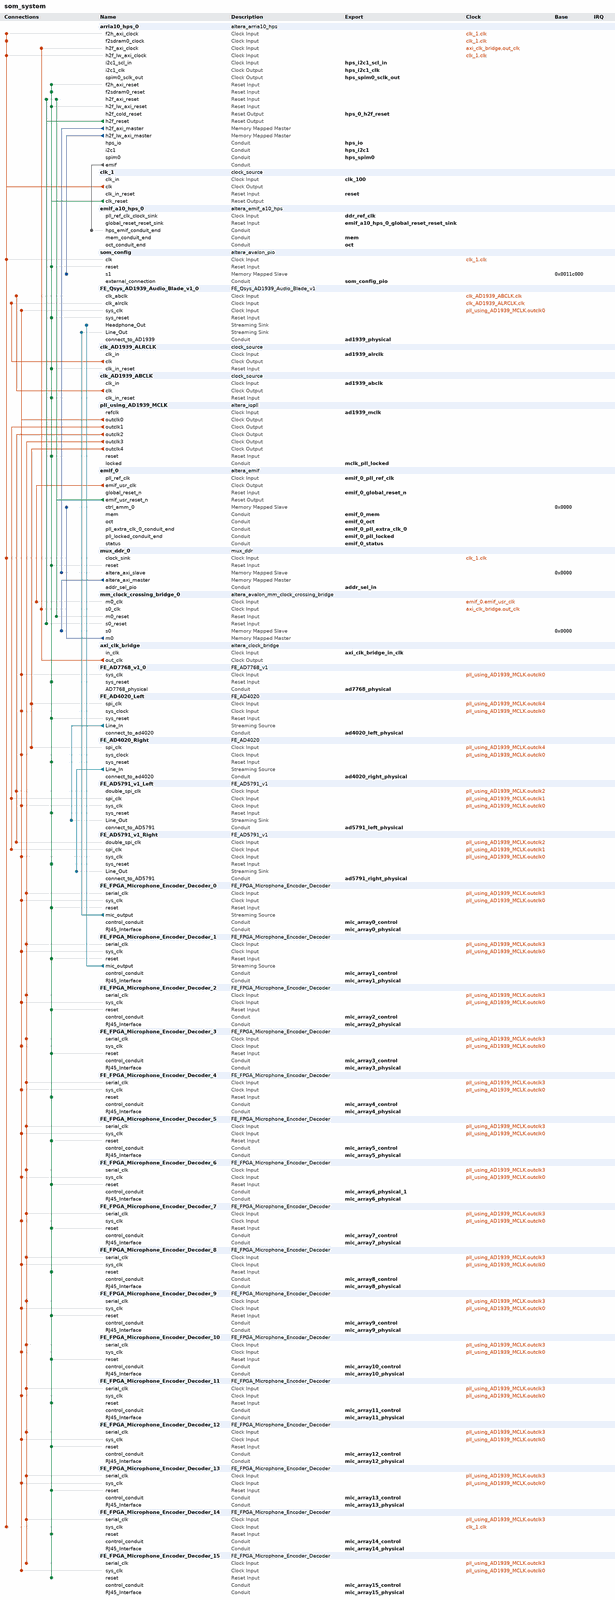
[diagram p0: system contents, whole]
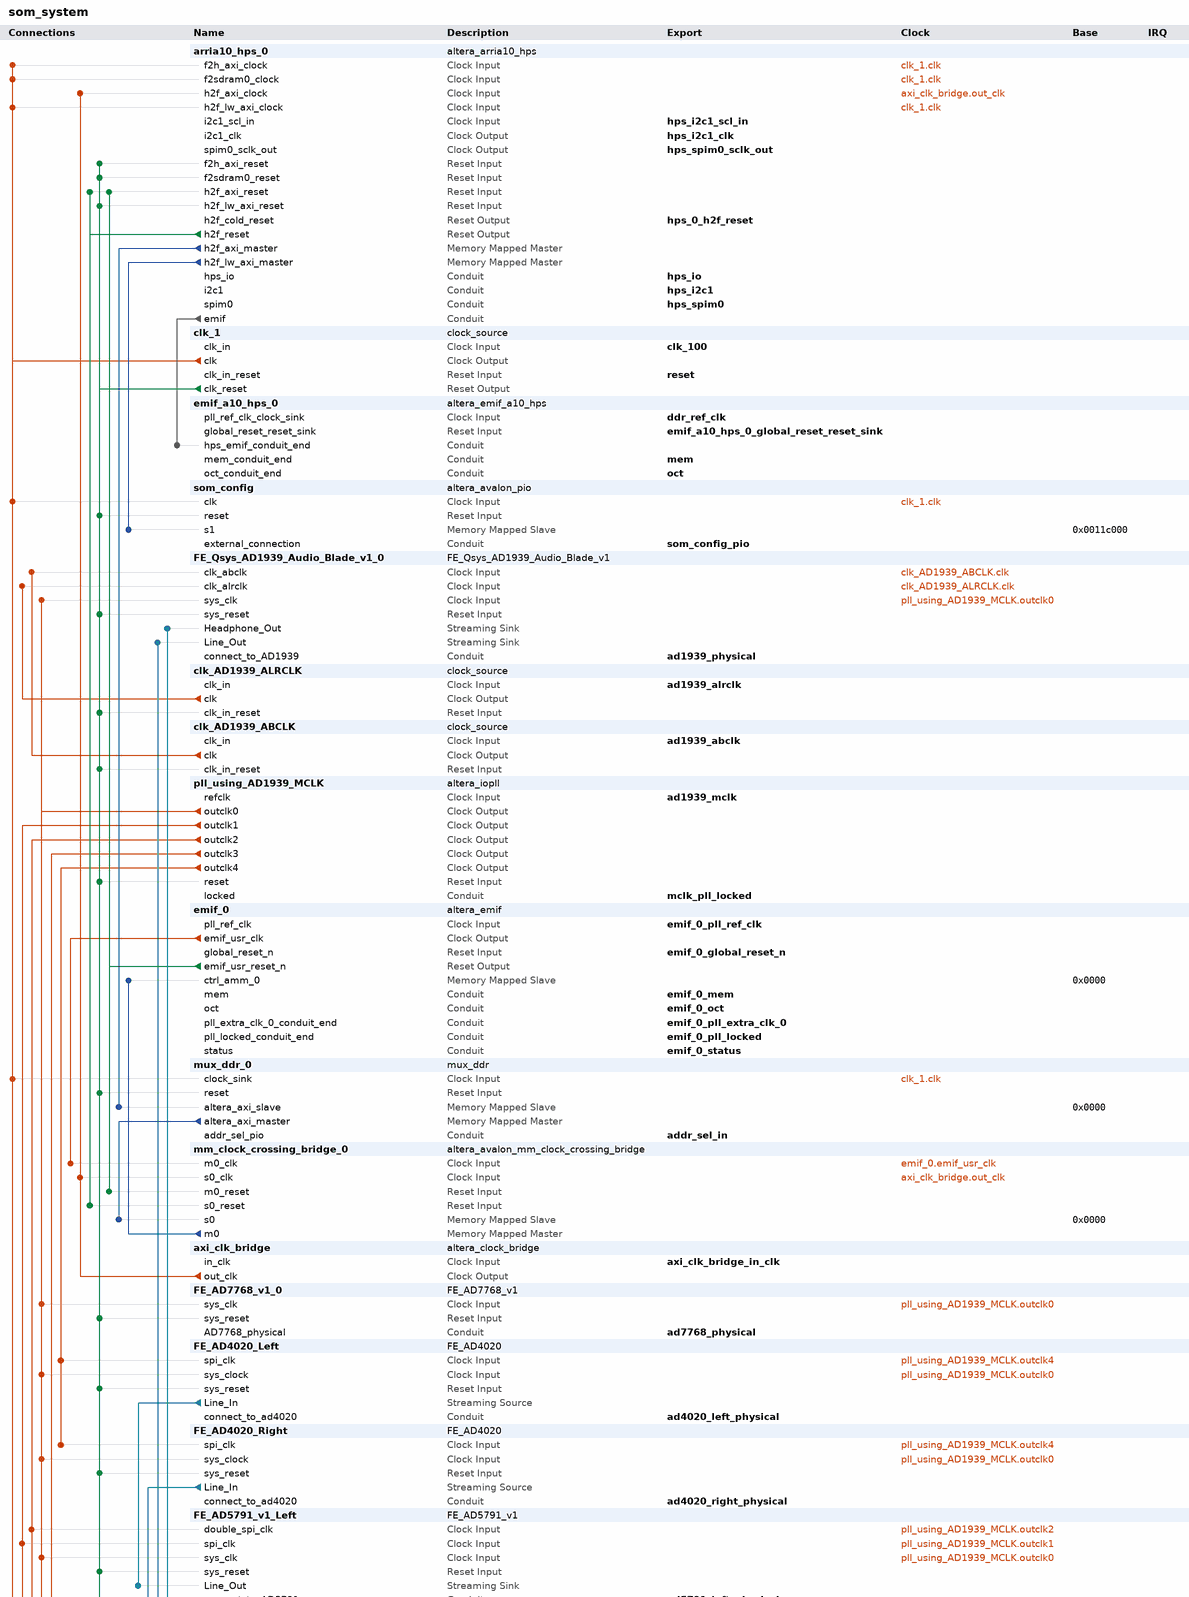
[diagram p1: system contents, upper part]
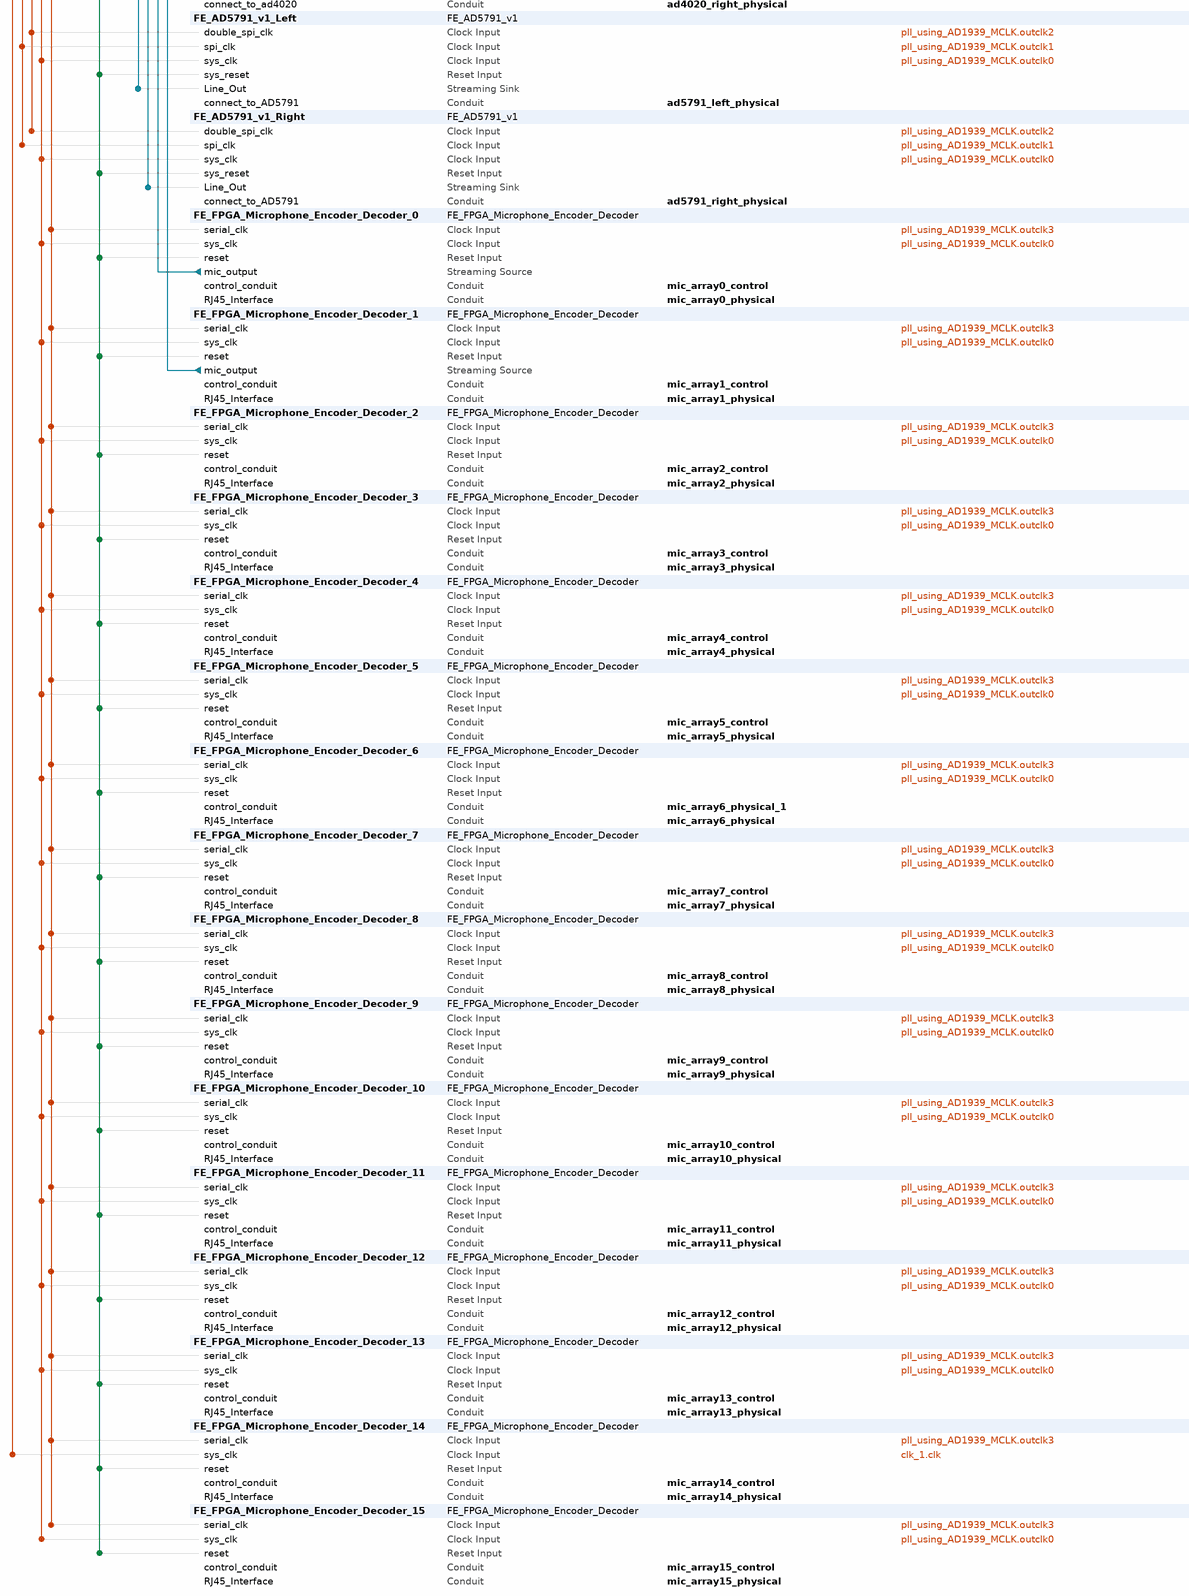
[diagram p2: system contents, lower part]
# Platform Designer (Qsys) system som_system, Arria 10 10AS066H2F34I1HG
# Parameters at their usual value, and those the tool derives, are not listed.
package require -exact qsys 18.0
create_system som_system
set_project_property DEVICE_FAMILY {Arria 10}
set_project_property DEVICE 10AS066H2F34I1HG

add_instance arria10_hps_0 altera_arria10_hps 18.0
set_instance_parameter_value arria10_hps_0 BOOT_FROM_FPGA_Enable false
set_instance_parameter_value arria10_hps_0 BSEL 1
set_instance_parameter_value arria10_hps_0 BSEL_EN false
set_instance_parameter_value arria10_hps_0 CLK_EMACA_SOURCE 1
set_instance_parameter_value arria10_hps_0 CLK_EMACB_SOURCE 1
set_instance_parameter_value arria10_hps_0 CLK_EMAC_PTP_SOURCE 1
set_instance_parameter_value arria10_hps_0 CLK_GPIO_SOURCE 1
set_instance_parameter_value arria10_hps_0 CLK_HMC_PLL_SOURCE 0
set_instance_parameter_value arria10_hps_0 CLK_MAIN_PLL_SOURCE2 0
set_instance_parameter_value arria10_hps_0 CLK_MPU_CNT 0
set_instance_parameter_value arria10_hps_0 CLK_MPU_SOURCE 0
set_instance_parameter_value arria10_hps_0 CLK_NOC_CNT 0
set_instance_parameter_value arria10_hps_0 CLK_NOC_SOURCE 0
set_instance_parameter_value arria10_hps_0 CLK_PERI_PLL_SOURCE2 0
set_instance_parameter_value arria10_hps_0 CLK_S2F_USER0_SOURCE 0
set_instance_parameter_value arria10_hps_0 CLK_S2F_USER1_SOURCE 0
set_instance_parameter_value arria10_hps_0 CLK_SDMMC_SOURCE 0
set_instance_parameter_value arria10_hps_0 CM_Mode N/A
set_instance_parameter_value arria10_hps_0 CM_PinMuxing Unused
set_instance_parameter_value arria10_hps_0 CTI_Enable false
set_instance_parameter_value arria10_hps_0 CUSTOM_MPU_CLK 800
set_instance_parameter_value arria10_hps_0 DEBUG_APB_Enable false
set_instance_parameter_value arria10_hps_0 DISABLE_PERI_PLL false
set_instance_parameter_value arria10_hps_0 DMA_Enable No,No,No,No,No,No,No,No
set_instance_parameter_value arria10_hps_0 EMAC0_CLK 250
set_instance_parameter_value arria10_hps_0 EMAC0_Mode N/A
set_instance_parameter_value arria10_hps_0 EMAC0_PTP false
set_instance_parameter_value arria10_hps_0 EMAC0_PinMuxing Unused
set_instance_parameter_value arria10_hps_0 EMAC0_SWITCH_Enable false
set_instance_parameter_value arria10_hps_0 EMAC1_CLK 250
set_instance_parameter_value arria10_hps_0 EMAC1_Mode RGMII_with_MDIO
set_instance_parameter_value arria10_hps_0 EMAC1_PTP false
set_instance_parameter_value arria10_hps_0 EMAC1_PinMuxing IO
set_instance_parameter_value arria10_hps_0 EMAC1_SWITCH_Enable false
set_instance_parameter_value arria10_hps_0 EMAC2_CLK 250
set_instance_parameter_value arria10_hps_0 EMAC2_Mode N/A
set_instance_parameter_value arria10_hps_0 EMAC2_PTP false
set_instance_parameter_value arria10_hps_0 EMAC2_PinMuxing Unused
set_instance_parameter_value arria10_hps_0 EMAC2_SWITCH_Enable false
set_instance_parameter_value arria10_hps_0 EMAC_PTP_REF_CLK 100
set_instance_parameter_value arria10_hps_0 EMIF_BYPASS_CHECK false
set_instance_parameter_value arria10_hps_0 EMIF_CONDUIT_Enable true
set_instance_parameter_value arria10_hps_0 F2H_AXI_CLOCK_FREQ 100000000
set_instance_parameter_value arria10_hps_0 F2H_COLD_RST_Enable false
set_instance_parameter_value arria10_hps_0 F2H_DBG_RST_Enable false
set_instance_parameter_value arria10_hps_0 F2H_FREE_CLK_Enable false
set_instance_parameter_value arria10_hps_0 F2H_FREE_CLK_FREQ 200
set_instance_parameter_value arria10_hps_0 F2H_SDRAM0_CLOCK_FREQ 100
set_instance_parameter_value arria10_hps_0 F2H_SDRAM1_CLOCK_FREQ 100
set_instance_parameter_value arria10_hps_0 F2H_SDRAM2_CLOCK_FREQ 100
set_instance_parameter_value arria10_hps_0 F2H_SDRAM3_CLOCK_FREQ 100
set_instance_parameter_value arria10_hps_0 F2H_SDRAM4_CLOCK_FREQ 100
set_instance_parameter_value arria10_hps_0 F2H_SDRAM5_CLOCK_FREQ 100
set_instance_parameter_value arria10_hps_0 F2H_WARM_RST_Enable false
set_instance_parameter_value arria10_hps_0 F2SDRAM0_ENABLED true
set_instance_parameter_value arria10_hps_0 F2SDRAM1_ENABLED false
set_instance_parameter_value arria10_hps_0 F2SDRAM2_DELAY 4
set_instance_parameter_value arria10_hps_0 F2SDRAM2_ENABLED false
set_instance_parameter_value arria10_hps_0 F2SDRAM_ADDRESS_WIDTH 32
set_instance_parameter_value arria10_hps_0 F2SDRAM_PORT_CONFIG 6
set_instance_parameter_value arria10_hps_0 F2SDRAM_READY_LATENCY true
set_instance_parameter_value arria10_hps_0 F2SINTERRUPT_Enable true
set_instance_parameter_value arria10_hps_0 F2S_Width 6
set_instance_parameter_value arria10_hps_0 FPGA_PERIPHERAL_INPUT_CLOCK_FREQ_EMAC0_RX_CLK_IN 100
set_instance_parameter_value arria10_hps_0 FPGA_PERIPHERAL_INPUT_CLOCK_FREQ_EMAC0_TX_CLK_IN 100
set_instance_parameter_value arria10_hps_0 FPGA_PERIPHERAL_INPUT_CLOCK_FREQ_EMAC1_RX_CLK_IN 100
set_instance_parameter_value arria10_hps_0 FPGA_PERIPHERAL_INPUT_CLOCK_FREQ_EMAC1_TX_CLK_IN 100
set_instance_parameter_value arria10_hps_0 FPGA_PERIPHERAL_INPUT_CLOCK_FREQ_EMAC2_RX_CLK_IN 100
set_instance_parameter_value arria10_hps_0 FPGA_PERIPHERAL_INPUT_CLOCK_FREQ_EMAC2_TX_CLK_IN 100
set_instance_parameter_value arria10_hps_0 FPGA_PERIPHERAL_INPUT_CLOCK_FREQ_EMAC_PTP_REF_CLOCK 100
set_instance_parameter_value arria10_hps_0 FPGA_PERIPHERAL_INPUT_CLOCK_FREQ_I2C0_SCL_IN 100
set_instance_parameter_value arria10_hps_0 FPGA_PERIPHERAL_INPUT_CLOCK_FREQ_I2C1_SCL_IN 0
set_instance_parameter_value arria10_hps_0 FPGA_PERIPHERAL_INPUT_CLOCK_FREQ_I2CEMAC0_SCL_IN 100
set_instance_parameter_value arria10_hps_0 FPGA_PERIPHERAL_INPUT_CLOCK_FREQ_I2CEMAC1_SCL_IN 100
set_instance_parameter_value arria10_hps_0 FPGA_PERIPHERAL_INPUT_CLOCK_FREQ_I2CEMAC2_SCL_IN 100
set_instance_parameter_value arria10_hps_0 FPGA_PERIPHERAL_INPUT_CLOCK_FREQ_SDMMC_CLK_IN 100
set_instance_parameter_value arria10_hps_0 FPGA_PERIPHERAL_INPUT_CLOCK_FREQ_SPIS0_SCLK_IN 100
set_instance_parameter_value arria10_hps_0 FPGA_PERIPHERAL_INPUT_CLOCK_FREQ_SPIS1_SCLK_IN 100
set_instance_parameter_value arria10_hps_0 FPGA_PERIPHERAL_INPUT_CLOCK_FREQ_USB0_CLK_IN 100
set_instance_parameter_value arria10_hps_0 FPGA_PERIPHERAL_INPUT_CLOCK_FREQ_USB1_CLK_IN 100
set_instance_parameter_value arria10_hps_0 FPGA_PERIPHERAL_OUTPUT_CLOCK_FREQ_EMAC0_GTX_CLK 100
set_instance_parameter_value arria10_hps_0 FPGA_PERIPHERAL_OUTPUT_CLOCK_FREQ_EMAC0_MD_CLK 2.5
set_instance_parameter_value arria10_hps_0 FPGA_PERIPHERAL_OUTPUT_CLOCK_FREQ_EMAC1_GTX_CLK 100
set_instance_parameter_value arria10_hps_0 FPGA_PERIPHERAL_OUTPUT_CLOCK_FREQ_EMAC1_MD_CLK 2.5
set_instance_parameter_value arria10_hps_0 FPGA_PERIPHERAL_OUTPUT_CLOCK_FREQ_EMAC2_GTX_CLK 100
set_instance_parameter_value arria10_hps_0 FPGA_PERIPHERAL_OUTPUT_CLOCK_FREQ_EMAC2_MD_CLK 2.5
set_instance_parameter_value arria10_hps_0 FPGA_PERIPHERAL_OUTPUT_CLOCK_FREQ_I2C0_CLK 100
set_instance_parameter_value arria10_hps_0 FPGA_PERIPHERAL_OUTPUT_CLOCK_FREQ_I2C1_CLK 100
set_instance_parameter_value arria10_hps_0 FPGA_PERIPHERAL_OUTPUT_CLOCK_FREQ_I2CEMAC0_CLK 100
set_instance_parameter_value arria10_hps_0 FPGA_PERIPHERAL_OUTPUT_CLOCK_FREQ_I2CEMAC1_CLK 100
set_instance_parameter_value arria10_hps_0 FPGA_PERIPHERAL_OUTPUT_CLOCK_FREQ_I2CEMAC2_CLK 100
set_instance_parameter_value arria10_hps_0 FPGA_PERIPHERAL_OUTPUT_CLOCK_FREQ_QSPI_SCLK_OUT 100
set_instance_parameter_value arria10_hps_0 FPGA_PERIPHERAL_OUTPUT_CLOCK_FREQ_SDMMC_CCLK 100
set_instance_parameter_value arria10_hps_0 FPGA_PERIPHERAL_OUTPUT_CLOCK_FREQ_SPIM0_SCLK_OUT 100
set_instance_parameter_value arria10_hps_0 FPGA_PERIPHERAL_OUTPUT_CLOCK_FREQ_SPIM1_SCLK_OUT 100
set_instance_parameter_value arria10_hps_0 GPIO_REF_CLK 4
set_instance_parameter_value arria10_hps_0 GP_Enable false
set_instance_parameter_value arria10_hps_0 H2F_AXI_CLOCK_FREQ 0
set_instance_parameter_value arria10_hps_0 H2F_COLD_RST_Enable true
set_instance_parameter_value arria10_hps_0 H2F_CTI_CLOCK_FREQ 100
set_instance_parameter_value arria10_hps_0 H2F_DEBUG_APB_CLOCK_FREQ 100
set_instance_parameter_value arria10_hps_0 H2F_LW_AXI_CLOCK_FREQ 100000000
set_instance_parameter_value arria10_hps_0 H2F_PENDING_RST_Enable false
set_instance_parameter_value arria10_hps_0 H2F_TPIU_CLOCK_IN_FREQ 100
set_instance_parameter_value arria10_hps_0 H2F_USER0_CLK_Enable true
set_instance_parameter_value arria10_hps_0 H2F_USER0_CLK_FREQ 100
set_instance_parameter_value arria10_hps_0 H2F_USER1_CLK_Enable false
set_instance_parameter_value arria10_hps_0 H2F_USER1_CLK_FREQ 400
set_instance_parameter_value arria10_hps_0 HMC_PLL_REF_CLK 800
set_instance_parameter_value arria10_hps_0 HPS_DIV_GPIO_FREQ 125
set_instance_parameter_value arria10_hps_0 HPS_IO_Enable SDMMC:D0,SDMMC:CMD,SDMMC:CCLK,SDMMC:D1,SDMMC:D2,SDMMC:D3,GPIO,NONE,GPIO,NONE,NONE,NONE,UART1:TX,UART1:RX,GPIO,GPIO,NONE,NONE,I2C0:SDA,I2C0:SCL,GPIO,NONE,MDIO1:MDIO,MDIO1:MDC,NONE,GPIO,USB1:CLK,USB1:STP,USB1:DIR,USB1:DATA0,USB1:DATA1,USB1:NXT,USB1:DATA2,USB1:DATA3,USB1:DATA4,USB1:DATA5,USB1:DATA6,USB1:DATA7,EMAC1:TX_CLK,EMAC1:TX_CTL,EMAC1:RX_CLK,EMAC1:RX_CTL,EMAC1:TXD0,EMAC1:TXD1,EMAC1:RXD0,EMAC1:RXD1,EMAC1:TXD2,EMAC1:TXD3,EMAC1:RXD2,EMAC1:RXD3,GPIO,GPIO,GPIO,GPIO,GPIO,GPIO,GPIO,GPIO,GPIO,GPIO,GPIO,GPIO
set_instance_parameter_value arria10_hps_0 I2C0_Mode default
set_instance_parameter_value arria10_hps_0 I2C0_PinMuxing IO
set_instance_parameter_value arria10_hps_0 I2C1_Mode default
set_instance_parameter_value arria10_hps_0 I2C1_PinMuxing FPGA
set_instance_parameter_value arria10_hps_0 I2CEMAC0_Mode N/A
set_instance_parameter_value arria10_hps_0 I2CEMAC0_PinMuxing Unused
set_instance_parameter_value arria10_hps_0 I2CEMAC1_Mode N/A
set_instance_parameter_value arria10_hps_0 I2CEMAC1_PinMuxing Unused
set_instance_parameter_value arria10_hps_0 I2CEMAC2_Mode N/A
set_instance_parameter_value arria10_hps_0 I2CEMAC2_PinMuxing Unused
set_instance_parameter_value arria10_hps_0 INTERNAL_OSCILLATOR_ENABLE 60
set_instance_parameter_value arria10_hps_0 JTAG_Enable false
set_instance_parameter_value arria10_hps_0 L3_MAIN_FREE_CLK 500
set_instance_parameter_value arria10_hps_0 L4_SYS_FREE_CLK 1
set_instance_parameter_value arria10_hps_0 LWH2F_Enable 2
set_instance_parameter_value arria10_hps_0 MPU_CLK_VCCL 1
set_instance_parameter_value arria10_hps_0 MPU_EVENTS_Enable false
set_instance_parameter_value arria10_hps_0 NAND_Mode N/A
set_instance_parameter_value arria10_hps_0 NAND_PinMuxing Unused
set_instance_parameter_value arria10_hps_0 NOCDIV_CS_ATCLK 0
set_instance_parameter_value arria10_hps_0 NOCDIV_CS_PDBGCLK 1
set_instance_parameter_value arria10_hps_0 NOCDIV_CS_TRACECLK 0
set_instance_parameter_value arria10_hps_0 NOCDIV_L4MAINCLK 0
set_instance_parameter_value arria10_hps_0 NOCDIV_L4MPCLK 1
set_instance_parameter_value arria10_hps_0 NOCDIV_L4SPCLK 2
set_instance_parameter_value arria10_hps_0 OVERIDE_PERI_PLL false
set_instance_parameter_value arria10_hps_0 PERI_PLL_MANUAL_VCO_FREQ 2000
set_instance_parameter_value arria10_hps_0 PLL_CLK0 Unused
set_instance_parameter_value arria10_hps_0 PLL_CLK1 Unused
set_instance_parameter_value arria10_hps_0 PLL_CLK2 Unused
set_instance_parameter_value arria10_hps_0 PLL_CLK3 Unused
set_instance_parameter_value arria10_hps_0 PLL_CLK4 Unused
set_instance_parameter_value arria10_hps_0 QSPI_Mode N/A
set_instance_parameter_value arria10_hps_0 QSPI_PinMuxing Unused
set_instance_parameter_value arria10_hps_0 RUN_INTERNAL_BUILD_CHECKS 0
set_instance_parameter_value arria10_hps_0 S2FINTERRUPT_CLOCKPERIPHERAL_Enable false
set_instance_parameter_value arria10_hps_0 S2FINTERRUPT_CTI_Enable false
set_instance_parameter_value arria10_hps_0 S2FINTERRUPT_DMA_Enable false
set_instance_parameter_value arria10_hps_0 S2FINTERRUPT_EMAC0_Enable false
set_instance_parameter_value arria10_hps_0 S2FINTERRUPT_EMAC1_Enable false
set_instance_parameter_value arria10_hps_0 S2FINTERRUPT_EMAC2_Enable false
set_instance_parameter_value arria10_hps_0 S2FINTERRUPT_FPGAMANAGER_Enable false
set_instance_parameter_value arria10_hps_0 S2FINTERRUPT_GPIO_Enable false
set_instance_parameter_value arria10_hps_0 S2FINTERRUPT_HMC_Enable false
set_instance_parameter_value arria10_hps_0 S2FINTERRUPT_I2C0_Enable false
set_instance_parameter_value arria10_hps_0 S2FINTERRUPT_I2C1_Enable false
set_instance_parameter_value arria10_hps_0 S2FINTERRUPT_I2CEMAC0_Enable false
set_instance_parameter_value arria10_hps_0 S2FINTERRUPT_I2CEMAC1_Enable false
set_instance_parameter_value arria10_hps_0 S2FINTERRUPT_I2CEMAC2_Enable false
set_instance_parameter_value arria10_hps_0 S2FINTERRUPT_L4TIMER_Enable false
set_instance_parameter_value arria10_hps_0 S2FINTERRUPT_NAND_Enable false
set_instance_parameter_value arria10_hps_0 S2FINTERRUPT_QSPI_Enable false
set_instance_parameter_value arria10_hps_0 S2FINTERRUPT_SDMMC_Enable false
set_instance_parameter_value arria10_hps_0 S2FINTERRUPT_SPIM0_Enable false
set_instance_parameter_value arria10_hps_0 S2FINTERRUPT_SPIM1_Enable false
set_instance_parameter_value arria10_hps_0 S2FINTERRUPT_SPIS0_Enable false
set_instance_parameter_value arria10_hps_0 S2FINTERRUPT_SPIS1_Enable false
set_instance_parameter_value arria10_hps_0 S2FINTERRUPT_SYSTEMMANAGER_Enable false
set_instance_parameter_value arria10_hps_0 S2FINTERRUPT_SYSTIMER_Enable false
set_instance_parameter_value arria10_hps_0 S2FINTERRUPT_UART0_Enable false
set_instance_parameter_value arria10_hps_0 S2FINTERRUPT_UART1_Enable false
set_instance_parameter_value arria10_hps_0 S2FINTERRUPT_USB0_Enable false
set_instance_parameter_value arria10_hps_0 S2FINTERRUPT_USB1_Enable false
set_instance_parameter_value arria10_hps_0 S2FINTERRUPT_WATCHDOG_Enable false
set_instance_parameter_value arria10_hps_0 S2F_Width 6
set_instance_parameter_value arria10_hps_0 SDMMC_Mode 4-bit
set_instance_parameter_value arria10_hps_0 SDMMC_PinMuxing IO
set_instance_parameter_value arria10_hps_0 SDMMC_REF_CLK 200
set_instance_parameter_value arria10_hps_0 SECURITY_MODULE_Enable false
set_instance_parameter_value arria10_hps_0 SPIM0_Mode Single_slave_selects
set_instance_parameter_value arria10_hps_0 SPIM0_PinMuxing FPGA
set_instance_parameter_value arria10_hps_0 SPIM1_Mode N/A
set_instance_parameter_value arria10_hps_0 SPIM1_PinMuxing Unused
set_instance_parameter_value arria10_hps_0 SPIS0_Mode N/A
set_instance_parameter_value arria10_hps_0 SPIS0_PinMuxing Unused
set_instance_parameter_value arria10_hps_0 SPIS1_Mode N/A
set_instance_parameter_value arria10_hps_0 SPIS1_PinMuxing Unused
set_instance_parameter_value arria10_hps_0 STM_Enable false
set_instance_parameter_value arria10_hps_0 TESTIOCTRL_DEBUGCLKSEL 16
set_instance_parameter_value arria10_hps_0 TESTIOCTRL_MAINCLKSEL 8
set_instance_parameter_value arria10_hps_0 TESTIOCTRL_PERICLKSEL 8
set_instance_parameter_value arria10_hps_0 TEST_Enable false
set_instance_parameter_value arria10_hps_0 TRACE_Mode N/A
set_instance_parameter_value arria10_hps_0 TRACE_PinMuxing Unused
set_instance_parameter_value arria10_hps_0 UART0_Mode N/A
set_instance_parameter_value arria10_hps_0 UART0_PinMuxing Unused
set_instance_parameter_value arria10_hps_0 UART1_Mode No_flow_control
set_instance_parameter_value arria10_hps_0 UART1_PinMuxing IO
set_instance_parameter_value arria10_hps_0 USB0_Mode N/A
set_instance_parameter_value arria10_hps_0 USB0_PinMuxing Unused
set_instance_parameter_value arria10_hps_0 USB1_Mode default
set_instance_parameter_value arria10_hps_0 USB1_PinMuxing IO
set_instance_parameter_value arria10_hps_0 USE_DEFAULT_MPU_CLK false
set_instance_parameter_value arria10_hps_0 device_name 10AS066H2F34I1HG
set_instance_parameter_value arria10_hps_0 eosc1_clk_mhz 25.0
set_instance_parameter_value arria10_hps_0 quartus_ini_hps_ip_boot_from_fpga_ready false
set_instance_parameter_value arria10_hps_0 quartus_ini_hps_ip_enable_a10_advanced_options false
set_instance_parameter_value arria10_hps_0 quartus_ini_hps_ip_enable_jtag false
set_instance_parameter_value arria10_hps_0 quartus_ini_hps_ip_enable_sdmmc_clk_in false
set_instance_parameter_value arria10_hps_0 quartus_ini_hps_ip_enable_test_interface false
set_instance_parameter_value arria10_hps_0 quartus_ini_hps_ip_overide_f2sdram_delay false
set_instance_parameter_value arria10_hps_0 quartus_ini_hps_ip_override_sdmmc_4bit false

add_instance clk_1 clock_source 18.0
set_instance_parameter_value clk_1 clockFrequency 100000000

add_instance emif_a10_hps_0 altera_emif_a10_hps 18.0
set_instance_parameter_value emif_a10_hps_0 BOARD_DDR3_AC_TO_CK_SKEW_NS 0.0
set_instance_parameter_value emif_a10_hps_0 BOARD_DDR3_BRD_SKEW_WITHIN_AC_NS 0.02
set_instance_parameter_value emif_a10_hps_0 BOARD_DDR3_BRD_SKEW_WITHIN_DQS_NS 0.02
set_instance_parameter_value emif_a10_hps_0 BOARD_DDR3_DQS_TO_CK_SKEW_NS 0.02
set_instance_parameter_value emif_a10_hps_0 BOARD_DDR3_IS_SKEW_WITHIN_AC_DESKEWED true
set_instance_parameter_value emif_a10_hps_0 BOARD_DDR3_IS_SKEW_WITHIN_DQS_DESKEWED false
set_instance_parameter_value emif_a10_hps_0 BOARD_DDR3_MAX_CK_DELAY_NS 0.6
set_instance_parameter_value emif_a10_hps_0 BOARD_DDR3_MAX_DQS_DELAY_NS 0.6
set_instance_parameter_value emif_a10_hps_0 BOARD_DDR3_PKG_BRD_SKEW_WITHIN_AC_NS 0.02
set_instance_parameter_value emif_a10_hps_0 BOARD_DDR3_PKG_BRD_SKEW_WITHIN_DQS_NS 0.02
set_instance_parameter_value emif_a10_hps_0 BOARD_DDR3_SKEW_BETWEEN_DIMMS_NS 0.05
set_instance_parameter_value emif_a10_hps_0 BOARD_DDR3_SKEW_BETWEEN_DQS_NS 0.02
set_instance_parameter_value emif_a10_hps_0 BOARD_DDR3_USER_AC_ISI_NS 0.0
set_instance_parameter_value emif_a10_hps_0 BOARD_DDR3_USER_AC_SLEW_RATE 2.0
set_instance_parameter_value emif_a10_hps_0 BOARD_DDR3_USER_CK_SLEW_RATE 4.0
set_instance_parameter_value emif_a10_hps_0 BOARD_DDR3_USER_RCLK_ISI_NS 0.0
set_instance_parameter_value emif_a10_hps_0 BOARD_DDR3_USER_RCLK_SLEW_RATE 5.0
set_instance_parameter_value emif_a10_hps_0 BOARD_DDR3_USER_RDATA_ISI_NS 0.0
set_instance_parameter_value emif_a10_hps_0 BOARD_DDR3_USER_RDATA_SLEW_RATE 2.5
set_instance_parameter_value emif_a10_hps_0 BOARD_DDR3_USER_WCLK_ISI_NS 0.0
set_instance_parameter_value emif_a10_hps_0 BOARD_DDR3_USER_WCLK_SLEW_RATE 4.0
set_instance_parameter_value emif_a10_hps_0 BOARD_DDR3_USER_WDATA_ISI_NS 0.0
set_instance_parameter_value emif_a10_hps_0 BOARD_DDR3_USER_WDATA_SLEW_RATE 2.0
set_instance_parameter_value emif_a10_hps_0 BOARD_DDR3_USE_DEFAULT_ISI_VALUES true
set_instance_parameter_value emif_a10_hps_0 BOARD_DDR3_USE_DEFAULT_SLEW_RATES true
set_instance_parameter_value emif_a10_hps_0 BOARD_DDR4_AC_TO_CK_SKEW_NS 0.00626847769365872
set_instance_parameter_value emif_a10_hps_0 BOARD_DDR4_BRD_SKEW_WITHIN_AC_NS 0.00702600796212221
set_instance_parameter_value emif_a10_hps_0 BOARD_DDR4_BRD_SKEW_WITHIN_DQS_NS 0.02
set_instance_parameter_value emif_a10_hps_0 BOARD_DDR4_DQS_TO_CK_SKEW_NS 0.629645021322697
set_instance_parameter_value emif_a10_hps_0 BOARD_DDR4_IS_SKEW_WITHIN_AC_DESKEWED true
set_instance_parameter_value emif_a10_hps_0 BOARD_DDR4_IS_SKEW_WITHIN_DQS_DESKEWED true
set_instance_parameter_value emif_a10_hps_0 BOARD_DDR4_MAX_CK_DELAY_NS 0.629749023117685
set_instance_parameter_value emif_a10_hps_0 BOARD_DDR4_MAX_DQS_DELAY_NS 0.0
set_instance_parameter_value emif_a10_hps_0 BOARD_DDR4_PKG_BRD_SKEW_WITHIN_AC_NS 0.00702600796212221
set_instance_parameter_value emif_a10_hps_0 BOARD_DDR4_PKG_BRD_SKEW_WITHIN_DQS_NS 0.00363630535370237
set_instance_parameter_value emif_a10_hps_0 BOARD_DDR4_SKEW_BETWEEN_DIMMS_NS 0.05
set_instance_parameter_value emif_a10_hps_0 BOARD_DDR4_SKEW_BETWEEN_DQS_NS 0.02
set_instance_parameter_value emif_a10_hps_0 BOARD_DDR4_USER_AC_ISI_NS 0.0
set_instance_parameter_value emif_a10_hps_0 BOARD_DDR4_USER_AC_SLEW_RATE 2.0
set_instance_parameter_value emif_a10_hps_0 BOARD_DDR4_USER_CK_SLEW_RATE 4.0
set_instance_parameter_value emif_a10_hps_0 BOARD_DDR4_USER_RCLK_ISI_NS 0.0
set_instance_parameter_value emif_a10_hps_0 BOARD_DDR4_USER_RCLK_SLEW_RATE 8.0
set_instance_parameter_value emif_a10_hps_0 BOARD_DDR4_USER_RDATA_ISI_NS 0.0
set_instance_parameter_value emif_a10_hps_0 BOARD_DDR4_USER_RDATA_SLEW_RATE 4.0
set_instance_parameter_value emif_a10_hps_0 BOARD_DDR4_USER_WCLK_ISI_NS 0.0
set_instance_parameter_value emif_a10_hps_0 BOARD_DDR4_USER_WCLK_SLEW_RATE 4.0
set_instance_parameter_value emif_a10_hps_0 BOARD_DDR4_USER_WDATA_ISI_NS 0.0
set_instance_parameter_value emif_a10_hps_0 BOARD_DDR4_USER_WDATA_SLEW_RATE 2.0
set_instance_parameter_value emif_a10_hps_0 BOARD_DDR4_USE_DEFAULT_ISI_VALUES true
set_instance_parameter_value emif_a10_hps_0 BOARD_DDR4_USE_DEFAULT_SLEW_RATES true
set_instance_parameter_value emif_a10_hps_0 BOARD_LPDDR3_AC_TO_CK_SKEW_NS 0.0
set_instance_parameter_value emif_a10_hps_0 BOARD_LPDDR3_BRD_SKEW_WITHIN_AC_NS 0.02
set_instance_parameter_value emif_a10_hps_0 BOARD_LPDDR3_BRD_SKEW_WITHIN_DQS_NS 0.02
set_instance_parameter_value emif_a10_hps_0 BOARD_LPDDR3_DQS_TO_CK_SKEW_NS 0.02
set_instance_parameter_value emif_a10_hps_0 BOARD_LPDDR3_IS_SKEW_WITHIN_AC_DESKEWED true
set_instance_parameter_value emif_a10_hps_0 BOARD_LPDDR3_IS_SKEW_WITHIN_DQS_DESKEWED false
set_instance_parameter_value emif_a10_hps_0 BOARD_LPDDR3_MAX_CK_DELAY_NS 0.6
set_instance_parameter_value emif_a10_hps_0 BOARD_LPDDR3_MAX_DQS_DELAY_NS 0.6
set_instance_parameter_value emif_a10_hps_0 BOARD_LPDDR3_PKG_BRD_SKEW_WITHIN_AC_NS 0.02
set_instance_parameter_value emif_a10_hps_0 BOARD_LPDDR3_PKG_BRD_SKEW_WITHIN_DQS_NS 0.02
set_instance_parameter_value emif_a10_hps_0 BOARD_LPDDR3_SKEW_BETWEEN_DIMMS_NS 0.05
set_instance_parameter_value emif_a10_hps_0 BOARD_LPDDR3_SKEW_BETWEEN_DQS_NS 0.02
set_instance_parameter_value emif_a10_hps_0 BOARD_LPDDR3_USER_AC_ISI_NS 0.0
set_instance_parameter_value emif_a10_hps_0 BOARD_LPDDR3_USER_AC_SLEW_RATE 2.0
set_instance_parameter_value emif_a10_hps_0 BOARD_LPDDR3_USER_CK_SLEW_RATE 4.0
set_instance_parameter_value emif_a10_hps_0 BOARD_LPDDR3_USER_RCLK_ISI_NS 0.0
set_instance_parameter_value emif_a10_hps_0 BOARD_LPDDR3_USER_RCLK_SLEW_RATE 4.0
set_instance_parameter_value emif_a10_hps_0 BOARD_LPDDR3_USER_RDATA_ISI_NS 0.0
set_instance_parameter_value emif_a10_hps_0 BOARD_LPDDR3_USER_RDATA_SLEW_RATE 2.0
set_instance_parameter_value emif_a10_hps_0 BOARD_LPDDR3_USER_WCLK_ISI_NS 0.0
set_instance_parameter_value emif_a10_hps_0 BOARD_LPDDR3_USER_WCLK_SLEW_RATE 4.0
set_instance_parameter_value emif_a10_hps_0 BOARD_LPDDR3_USER_WDATA_ISI_NS 0.0
set_instance_parameter_value emif_a10_hps_0 BOARD_LPDDR3_USER_WDATA_SLEW_RATE 2.0
set_instance_parameter_value emif_a10_hps_0 BOARD_LPDDR3_USE_DEFAULT_ISI_VALUES true
set_instance_parameter_value emif_a10_hps_0 BOARD_LPDDR3_USE_DEFAULT_SLEW_RATES true
set_instance_parameter_value emif_a10_hps_0 BOARD_QDR2_AC_TO_K_SKEW_NS 0.0
set_instance_parameter_value emif_a10_hps_0 BOARD_QDR2_BRD_SKEW_WITHIN_AC_NS 0.02
set_instance_parameter_value emif_a10_hps_0 BOARD_QDR2_BRD_SKEW_WITHIN_D_NS 0.02
set_instance_parameter_value emif_a10_hps_0 BOARD_QDR2_BRD_SKEW_WITHIN_Q_NS 0.02
set_instance_parameter_value emif_a10_hps_0 BOARD_QDR2_IS_SKEW_WITHIN_AC_DESKEWED true
set_instance_parameter_value emif_a10_hps_0 BOARD_QDR2_IS_SKEW_WITHIN_D_DESKEWED false
set_instance_parameter_value emif_a10_hps_0 BOARD_QDR2_IS_SKEW_WITHIN_Q_DESKEWED false
set_instance_parameter_value emif_a10_hps_0 BOARD_QDR2_MAX_K_DELAY_NS 0.6
set_instance_parameter_value emif_a10_hps_0 BOARD_QDR2_PKG_BRD_SKEW_WITHIN_AC_NS 0.02
set_instance_parameter_value emif_a10_hps_0 BOARD_QDR2_PKG_BRD_SKEW_WITHIN_D_NS 0.02
set_instance_parameter_value emif_a10_hps_0 BOARD_QDR2_PKG_BRD_SKEW_WITHIN_Q_NS 0.02
set_instance_parameter_value emif_a10_hps_0 BOARD_QDR2_USER_AC_ISI_NS 0.0
set_instance_parameter_value emif_a10_hps_0 BOARD_QDR2_USER_AC_SLEW_RATE 2.0
set_instance_parameter_value emif_a10_hps_0 BOARD_QDR2_USER_K_SLEW_RATE 4.0
set_instance_parameter_value emif_a10_hps_0 BOARD_QDR2_USER_RCLK_ISI_NS 0.0
set_instance_parameter_value emif_a10_hps_0 BOARD_QDR2_USER_RCLK_SLEW_RATE 4.0
set_instance_parameter_value emif_a10_hps_0 BOARD_QDR2_USER_RDATA_ISI_NS 0.0
set_instance_parameter_value emif_a10_hps_0 BOARD_QDR2_USER_RDATA_SLEW_RATE 2.0
set_instance_parameter_value emif_a10_hps_0 BOARD_QDR2_USER_WCLK_ISI_NS 0.0
set_instance_parameter_value emif_a10_hps_0 BOARD_QDR2_USER_WDATA_ISI_NS 0.0
set_instance_parameter_value emif_a10_hps_0 BOARD_QDR2_USER_WDATA_SLEW_RATE 2.0
set_instance_parameter_value emif_a10_hps_0 BOARD_QDR2_USE_DEFAULT_ISI_VALUES true
set_instance_parameter_value emif_a10_hps_0 BOARD_QDR2_USE_DEFAULT_SLEW_RATES true
set_instance_parameter_value emif_a10_hps_0 BOARD_QDR4_AC_TO_CK_SKEW_NS 0.0
set_instance_parameter_value emif_a10_hps_0 BOARD_QDR4_BRD_SKEW_WITHIN_AC_NS 0.02
set_instance_parameter_value emif_a10_hps_0 BOARD_QDR4_BRD_SKEW_WITHIN_QK_NS 0.02
set_instance_parameter_value emif_a10_hps_0 BOARD_QDR4_DK_TO_CK_SKEW_NS -0.02
set_instance_parameter_value emif_a10_hps_0 BOARD_QDR4_IS_SKEW_WITHIN_AC_DESKEWED true
set_instance_parameter_value emif_a10_hps_0 BOARD_QDR4_IS_SKEW_WITHIN_QK_DESKEWED true
set_instance_parameter_value emif_a10_hps_0 BOARD_QDR4_MAX_CK_DELAY_NS 0.6
set_instance_parameter_value emif_a10_hps_0 BOARD_QDR4_MAX_DK_DELAY_NS 0.6
set_instance_parameter_value emif_a10_hps_0 BOARD_QDR4_PKG_BRD_SKEW_WITHIN_AC_NS 0.02
set_instance_parameter_value emif_a10_hps_0 BOARD_QDR4_PKG_BRD_SKEW_WITHIN_QK_NS 0.02
set_instance_parameter_value emif_a10_hps_0 BOARD_QDR4_SKEW_BETWEEN_DIMMS_NS 0.05
set_instance_parameter_value emif_a10_hps_0 BOARD_QDR4_SKEW_BETWEEN_DK_NS 0.02
set_instance_parameter_value emif_a10_hps_0 BOARD_QDR4_USER_AC_ISI_NS 0.0
set_instance_parameter_value emif_a10_hps_0 BOARD_QDR4_USER_AC_SLEW_RATE 2.0
set_instance_parameter_value emif_a10_hps_0 BOARD_QDR4_USER_CK_SLEW_RATE 4.0
set_instance_parameter_value emif_a10_hps_0 BOARD_QDR4_USER_RCLK_ISI_NS 0.0
set_instance_parameter_value emif_a10_hps_0 BOARD_QDR4_USER_RCLK_SLEW_RATE 5.0
set_instance_parameter_value emif_a10_hps_0 BOARD_QDR4_USER_RDATA_ISI_NS 0.0
set_instance_parameter_value emif_a10_hps_0 BOARD_QDR4_USER_RDATA_SLEW_RATE 2.5
set_instance_parameter_value emif_a10_hps_0 BOARD_QDR4_USER_WCLK_ISI_NS 0.0
set_instance_parameter_value emif_a10_hps_0 BOARD_QDR4_USER_WCLK_SLEW_RATE 4.0
set_instance_parameter_value emif_a10_hps_0 BOARD_QDR4_USER_WDATA_ISI_NS 0.0
set_instance_parameter_value emif_a10_hps_0 BOARD_QDR4_USER_WDATA_SLEW_RATE 2.0
set_instance_parameter_value emif_a10_hps_0 BOARD_QDR4_USE_DEFAULT_ISI_VALUES true
set_instance_parameter_value emif_a10_hps_0 BOARD_QDR4_USE_DEFAULT_SLEW_RATES true
set_instance_parameter_value emif_a10_hps_0 BOARD_RLD3_AC_TO_CK_SKEW_NS 0.0
set_instance_parameter_value emif_a10_hps_0 BOARD_RLD3_BRD_SKEW_WITHIN_AC_NS 0.02
set_instance_parameter_value emif_a10_hps_0 BOARD_RLD3_BRD_SKEW_WITHIN_QK_NS 0.02
set_instance_parameter_value emif_a10_hps_0 BOARD_RLD3_DK_TO_CK_SKEW_NS -0.02
set_instance_parameter_value emif_a10_hps_0 BOARD_RLD3_IS_SKEW_WITHIN_AC_DESKEWED true
set_instance_parameter_value emif_a10_hps_0 BOARD_RLD3_IS_SKEW_WITHIN_QK_DESKEWED false
set_instance_parameter_value emif_a10_hps_0 BOARD_RLD3_MAX_CK_DELAY_NS 0.6
set_instance_parameter_value emif_a10_hps_0 BOARD_RLD3_MAX_DK_DELAY_NS 0.6
set_instance_parameter_value emif_a10_hps_0 BOARD_RLD3_PKG_BRD_SKEW_WITHIN_AC_NS 0.02
set_instance_parameter_value emif_a10_hps_0 BOARD_RLD3_PKG_BRD_SKEW_WITHIN_QK_NS 0.02
set_instance_parameter_value emif_a10_hps_0 BOARD_RLD3_SKEW_BETWEEN_DIMMS_NS 0.05
set_instance_parameter_value emif_a10_hps_0 BOARD_RLD3_SKEW_BETWEEN_DK_NS 0.02
set_instance_parameter_value emif_a10_hps_0 BOARD_RLD3_USER_AC_ISI_NS 0.0
set_instance_parameter_value emif_a10_hps_0 BOARD_RLD3_USER_AC_SLEW_RATE 2.0
set_instance_parameter_value emif_a10_hps_0 BOARD_RLD3_USER_CK_SLEW_RATE 4.0
set_instance_parameter_value emif_a10_hps_0 BOARD_RLD3_USER_RCLK_ISI_NS 0.0
set_instance_parameter_value emif_a10_hps_0 BOARD_RLD3_USER_RCLK_SLEW_RATE 7.0
set_instance_parameter_value emif_a10_hps_0 BOARD_RLD3_USER_RDATA_ISI_NS 0.0
set_instance_parameter_value emif_a10_hps_0 BOARD_RLD3_USER_RDATA_SLEW_RATE 3.5
set_instance_parameter_value emif_a10_hps_0 BOARD_RLD3_USER_WCLK_ISI_NS 0.0
set_instance_parameter_value emif_a10_hps_0 BOARD_RLD3_USER_WCLK_SLEW_RATE 4.0
set_instance_parameter_value emif_a10_hps_0 BOARD_RLD3_USER_WDATA_ISI_NS 0.0
set_instance_parameter_value emif_a10_hps_0 BOARD_RLD3_USER_WDATA_SLEW_RATE 2.0
set_instance_parameter_value emif_a10_hps_0 BOARD_RLD3_USE_DEFAULT_ISI_VALUES true
set_instance_parameter_value emif_a10_hps_0 BOARD_RLD3_USE_DEFAULT_SLEW_RATES true
set_instance_parameter_value emif_a10_hps_0 CAL_DEBUG_CLOCK_FREQUENCY 50000000
set_instance_parameter_value emif_a10_hps_0 CTRL_DDR3_ADDR_ORDER_ENUM DDR3_CTRL_ADDR_ORDER_CS_R_B_C
set_instance_parameter_value emif_a10_hps_0 CTRL_DDR3_AUTO_POWER_DOWN_CYCS 32
set_instance_parameter_value emif_a10_hps_0 CTRL_DDR3_AUTO_POWER_DOWN_EN false
set_instance_parameter_value emif_a10_hps_0 CTRL_DDR3_AUTO_PRECHARGE_EN false
set_instance_parameter_value emif_a10_hps_0 CTRL_DDR3_AVL_PROTOCOL_ENUM CTRL_AVL_PROTOCOL_ST
set_instance_parameter_value emif_a10_hps_0 CTRL_DDR3_ECC_AUTO_CORRECTION_EN false
set_instance_parameter_value emif_a10_hps_0 CTRL_DDR3_ECC_EN false
set_instance_parameter_value emif_a10_hps_0 CTRL_DDR3_MMR_EN false
set_instance_parameter_value emif_a10_hps_0 CTRL_DDR3_RD_TO_RD_DIFF_CHIP_DELTA_CYCS 0
set_instance_parameter_value emif_a10_hps_0 CTRL_DDR3_RD_TO_WR_DIFF_CHIP_DELTA_CYCS 0
set_instance_parameter_value emif_a10_hps_0 CTRL_DDR3_RD_TO_WR_SAME_CHIP_DELTA_CYCS 0
set_instance_parameter_value emif_a10_hps_0 CTRL_DDR3_REORDER_EN true
set_instance_parameter_value emif_a10_hps_0 CTRL_DDR3_SELF_REFRESH_EN false
set_instance_parameter_value emif_a10_hps_0 CTRL_DDR3_STARVE_LIMIT 10
set_instance_parameter_value emif_a10_hps_0 CTRL_DDR3_USER_PRIORITY_EN false
set_instance_parameter_value emif_a10_hps_0 CTRL_DDR3_USER_REFRESH_EN false
set_instance_parameter_value emif_a10_hps_0 CTRL_DDR3_WR_TO_RD_DIFF_CHIP_DELTA_CYCS 0
set_instance_parameter_value emif_a10_hps_0 CTRL_DDR3_WR_TO_RD_SAME_CHIP_DELTA_CYCS 0
set_instance_parameter_value emif_a10_hps_0 CTRL_DDR3_WR_TO_WR_DIFF_CHIP_DELTA_CYCS 0
set_instance_parameter_value emif_a10_hps_0 CTRL_DDR4_ADDR_ORDER_ENUM DDR4_CTRL_ADDR_ORDER_R_CS_B_C_BG
set_instance_parameter_value emif_a10_hps_0 CTRL_DDR4_AUTO_POWER_DOWN_CYCS 32
set_instance_parameter_value emif_a10_hps_0 CTRL_DDR4_AUTO_POWER_DOWN_EN false
set_instance_parameter_value emif_a10_hps_0 CTRL_DDR4_AUTO_PRECHARGE_EN false
set_instance_parameter_value emif_a10_hps_0 CTRL_DDR4_AVL_PROTOCOL_ENUM CTRL_AVL_PROTOCOL_ST
set_instance_parameter_value emif_a10_hps_0 CTRL_DDR4_ECC_AUTO_CORRECTION_EN false
set_instance_parameter_value emif_a10_hps_0 CTRL_DDR4_ECC_EN true
set_instance_parameter_value emif_a10_hps_0 CTRL_DDR4_MMR_EN false
set_instance_parameter_value emif_a10_hps_0 CTRL_DDR4_RD_TO_RD_DIFF_CHIP_DELTA_CYCS 0
set_instance_parameter_value emif_a10_hps_0 CTRL_DDR4_RD_TO_WR_DIFF_CHIP_DELTA_CYCS 0
set_instance_parameter_value emif_a10_hps_0 CTRL_DDR4_RD_TO_WR_SAME_CHIP_DELTA_CYCS 0
set_instance_parameter_value emif_a10_hps_0 CTRL_DDR4_REORDER_EN true
set_instance_parameter_value emif_a10_hps_0 CTRL_DDR4_SELF_REFRESH_EN false
set_instance_parameter_value emif_a10_hps_0 CTRL_DDR4_STARVE_LIMIT 10
set_instance_parameter_value emif_a10_hps_0 CTRL_DDR4_USER_PRIORITY_EN false
set_instance_parameter_value emif_a10_hps_0 CTRL_DDR4_USER_REFRESH_EN false
set_instance_parameter_value emif_a10_hps_0 CTRL_DDR4_WR_TO_RD_DIFF_CHIP_DELTA_CYCS 0
set_instance_parameter_value emif_a10_hps_0 CTRL_DDR4_WR_TO_RD_SAME_CHIP_DELTA_CYCS 0
set_instance_parameter_value emif_a10_hps_0 CTRL_DDR4_WR_TO_WR_DIFF_CHIP_DELTA_CYCS 0
set_instance_parameter_value emif_a10_hps_0 CTRL_LPDDR3_ADDR_ORDER_ENUM LPDDR3_CTRL_ADDR_ORDER_CS_R_B_C
set_instance_parameter_value emif_a10_hps_0 CTRL_LPDDR3_AUTO_POWER_DOWN_CYCS 32
set_instance_parameter_value emif_a10_hps_0 CTRL_LPDDR3_AUTO_POWER_DOWN_EN false
set_instance_parameter_value emif_a10_hps_0 CTRL_LPDDR3_AUTO_PRECHARGE_EN false
set_instance_parameter_value emif_a10_hps_0 CTRL_LPDDR3_AVL_PROTOCOL_ENUM CTRL_AVL_PROTOCOL_ST
set_instance_parameter_value emif_a10_hps_0 CTRL_LPDDR3_MMR_EN false
set_instance_parameter_value emif_a10_hps_0 CTRL_LPDDR3_RD_TO_RD_DIFF_CHIP_DELTA_CYCS 0
set_instance_parameter_value emif_a10_hps_0 CTRL_LPDDR3_RD_TO_WR_DIFF_CHIP_DELTA_CYCS 0
set_instance_parameter_value emif_a10_hps_0 CTRL_LPDDR3_RD_TO_WR_SAME_CHIP_DELTA_CYCS 0
set_instance_parameter_value emif_a10_hps_0 CTRL_LPDDR3_REORDER_EN true
set_instance_parameter_value emif_a10_hps_0 CTRL_LPDDR3_SELF_REFRESH_EN false
set_instance_parameter_value emif_a10_hps_0 CTRL_LPDDR3_STARVE_LIMIT 10
set_instance_parameter_value emif_a10_hps_0 CTRL_LPDDR3_USER_PRIORITY_EN false
set_instance_parameter_value emif_a10_hps_0 CTRL_LPDDR3_USER_REFRESH_EN false
set_instance_parameter_value emif_a10_hps_0 CTRL_LPDDR3_WR_TO_RD_DIFF_CHIP_DELTA_CYCS 0
set_instance_parameter_value emif_a10_hps_0 CTRL_LPDDR3_WR_TO_RD_SAME_CHIP_DELTA_CYCS 0
set_instance_parameter_value emif_a10_hps_0 CTRL_LPDDR3_WR_TO_WR_DIFF_CHIP_DELTA_CYCS 0
set_instance_parameter_value emif_a10_hps_0 CTRL_QDR2_AVL_ENABLE_POWER_OF_TWO_BUS false
set_instance_parameter_value emif_a10_hps_0 CTRL_QDR2_AVL_MAX_BURST_COUNT 4
set_instance_parameter_value emif_a10_hps_0 CTRL_QDR2_AVL_PROTOCOL_ENUM CTRL_AVL_PROTOCOL_MM
set_instance_parameter_value emif_a10_hps_0 CTRL_QDR4_ADD_RAW_TURNAROUND_DELAY_CYC 0
set_instance_parameter_value emif_a10_hps_0 CTRL_QDR4_ADD_WAR_TURNAROUND_DELAY_CYC 0
set_instance_parameter_value emif_a10_hps_0 CTRL_QDR4_AVL_ENABLE_POWER_OF_TWO_BUS false
set_instance_parameter_value emif_a10_hps_0 CTRL_QDR4_AVL_MAX_BURST_COUNT 4
set_instance_parameter_value emif_a10_hps_0 CTRL_QDR4_AVL_PROTOCOL_ENUM CTRL_AVL_PROTOCOL_MM
set_instance_parameter_value emif_a10_hps_0 CTRL_RLD2_AVL_PROTOCOL_ENUM CTRL_AVL_PROTOCOL_MM
set_instance_parameter_value emif_a10_hps_0 CTRL_RLD3_ADDR_ORDER_ENUM RLD3_CTRL_ADDR_ORDER_CS_R_B_C
set_instance_parameter_value emif_a10_hps_0 CTRL_RLD3_AVL_PROTOCOL_ENUM CTRL_AVL_PROTOCOL_MM
set_instance_parameter_value emif_a10_hps_0 DIAG_DDR3_ABSTRACT_PHY false
set_instance_parameter_value emif_a10_hps_0 DIAG_DDR3_BYPASS_DEFAULT_PATTERN false
set_instance_parameter_value emif_a10_hps_0 DIAG_DDR3_BYPASS_REPEAT_STAGE true
set_instance_parameter_value emif_a10_hps_0 DIAG_DDR3_BYPASS_STRESS_STAGE true
set_instance_parameter_value emif_a10_hps_0 DIAG_DDR3_BYPASS_USER_STAGE true
set_instance_parameter_value emif_a10_hps_0 DIAG_DDR3_CAL_ADDR0 0
set_instance_parameter_value emif_a10_hps_0 DIAG_DDR3_CAL_ADDR1 8
set_instance_parameter_value emif_a10_hps_0 DIAG_DDR3_CAL_ENABLE_NON_DES false
set_instance_parameter_value emif_a10_hps_0 DIAG_DDR3_CAL_FULL_CAL_ON_RESET true
set_instance_parameter_value emif_a10_hps_0 DIAG_DDR3_CA_LEVEL_EN false
set_instance_parameter_value emif_a10_hps_0 DIAG_DDR3_EFFICIENCY_MONITOR EFFMON_MODE_DISABLED
set_instance_parameter_value emif_a10_hps_0 DIAG_DDR3_EXPORT_SEQ_AVALON_MASTER false
set_instance_parameter_value emif_a10_hps_0 DIAG_DDR3_EXPORT_SEQ_AVALON_SLAVE CAL_DEBUG_EXPORT_MODE_DISABLED
set_instance_parameter_value emif_a10_hps_0 DIAG_DDR3_EX_DESIGN_ISSP_EN true
set_instance_parameter_value emif_a10_hps_0 DIAG_DDR3_EX_DESIGN_NUM_OF_SLAVES 1
set_instance_parameter_value emif_a10_hps_0 DIAG_DDR3_EX_DESIGN_SEPARATE_RZQS false
set_instance_parameter_value emif_a10_hps_0 DIAG_DDR3_INTERFACE_ID 0
set_instance_parameter_value emif_a10_hps_0 DIAG_DDR3_SEPARATE_READ_WRITE_ITFS false
set_instance_parameter_value emif_a10_hps_0 DIAG_DDR3_SIM_CAL_MODE_ENUM SIM_CAL_MODE_SKIP
set_instance_parameter_value emif_a10_hps_0 DIAG_DDR3_TG_BE_PATTERN_LENGTH 8
set_instance_parameter_value emif_a10_hps_0 DIAG_DDR3_TG_DATA_PATTERN_LENGTH 8
set_instance_parameter_value emif_a10_hps_0 DIAG_DDR3_USE_TG_AVL_2 false
set_instance_parameter_value emif_a10_hps_0 DIAG_DDR4_ABSTRACT_PHY false
set_instance_parameter_value emif_a10_hps_0 DIAG_DDR4_BYPASS_DEFAULT_PATTERN false
set_instance_parameter_value emif_a10_hps_0 DIAG_DDR4_BYPASS_REPEAT_STAGE true
set_instance_parameter_value emif_a10_hps_0 DIAG_DDR4_BYPASS_STRESS_STAGE true
set_instance_parameter_value emif_a10_hps_0 DIAG_DDR4_BYPASS_USER_STAGE true
set_instance_parameter_value emif_a10_hps_0 DIAG_DDR4_CAL_ADDR0 0
set_instance_parameter_value emif_a10_hps_0 DIAG_DDR4_CAL_ADDR1 8
set_instance_parameter_value emif_a10_hps_0 DIAG_DDR4_CAL_ENABLE_NON_DES false
set_instance_parameter_value emif_a10_hps_0 DIAG_DDR4_CAL_FULL_CAL_ON_RESET true
set_instance_parameter_value emif_a10_hps_0 DIAG_DDR4_EFFICIENCY_MONITOR EFFMON_MODE_DISABLED
set_instance_parameter_value emif_a10_hps_0 DIAG_DDR4_EXPORT_SEQ_AVALON_MASTER false
set_instance_parameter_value emif_a10_hps_0 DIAG_DDR4_EXPORT_SEQ_AVALON_SLAVE CAL_DEBUG_EXPORT_MODE_DISABLED
set_instance_parameter_value emif_a10_hps_0 DIAG_DDR4_EX_DESIGN_ISSP_EN true
set_instance_parameter_value emif_a10_hps_0 DIAG_DDR4_EX_DESIGN_NUM_OF_SLAVES 1
set_instance_parameter_value emif_a10_hps_0 DIAG_DDR4_EX_DESIGN_SEPARATE_RZQS false
set_instance_parameter_value emif_a10_hps_0 DIAG_DDR4_INTERFACE_ID 0
set_instance_parameter_value emif_a10_hps_0 DIAG_DDR4_SEPARATE_READ_WRITE_ITFS false
set_instance_parameter_value emif_a10_hps_0 DIAG_DDR4_SIM_CAL_MODE_ENUM SIM_CAL_MODE_SKIP
set_instance_parameter_value emif_a10_hps_0 DIAG_DDR4_SKIP_CA_DESKEW false
set_instance_parameter_value emif_a10_hps_0 DIAG_DDR4_SKIP_CA_LEVEL false
set_instance_parameter_value emif_a10_hps_0 DIAG_DDR4_SKIP_VREF_CAL false
set_instance_parameter_value emif_a10_hps_0 DIAG_DDR4_TG_BE_PATTERN_LENGTH 8
set_instance_parameter_value emif_a10_hps_0 DIAG_DDR4_TG_DATA_PATTERN_LENGTH 8
set_instance_parameter_value emif_a10_hps_0 DIAG_DDR4_USE_TG_AVL_2 false
set_instance_parameter_value emif_a10_hps_0 DIAG_ECLIPSE_DEBUG false
set_instance_parameter_value emif_a10_hps_0 DIAG_ENABLE_HPS_EMIF_DEBUG false
set_instance_parameter_value emif_a10_hps_0 DIAG_ENABLE_JTAG_UART false
set_instance_parameter_value emif_a10_hps_0 DIAG_ENABLE_JTAG_UART_HEX false
set_instance_parameter_value emif_a10_hps_0 DIAG_EXPORT_VJI false
set_instance_parameter_value emif_a10_hps_0 DIAG_EXPOSE_DFT_SIGNALS false
set_instance_parameter_value emif_a10_hps_0 DIAG_EXT_DOCS false
set_instance_parameter_value emif_a10_hps_0 DIAG_EX_DESIGN_SEPARATE_RESETS false
set_instance_parameter_value emif_a10_hps_0 DIAG_FAST_SIM_OVERRIDE FAST_SIM_OVERRIDE_DEFAULT
set_instance_parameter_value emif_a10_hps_0 DIAG_LPDDR3_ABSTRACT_PHY false
set_instance_parameter_value emif_a10_hps_0 DIAG_LPDDR3_BYPASS_DEFAULT_PATTERN false
set_instance_parameter_value emif_a10_hps_0 DIAG_LPDDR3_BYPASS_REPEAT_STAGE true
set_instance_parameter_value emif_a10_hps_0 DIAG_LPDDR3_BYPASS_STRESS_STAGE true
set_instance_parameter_value emif_a10_hps_0 DIAG_LPDDR3_BYPASS_USER_STAGE true
set_instance_parameter_value emif_a10_hps_0 DIAG_LPDDR3_EFFICIENCY_MONITOR EFFMON_MODE_DISABLED
set_instance_parameter_value emif_a10_hps_0 DIAG_LPDDR3_EXPORT_SEQ_AVALON_MASTER false
set_instance_parameter_value emif_a10_hps_0 DIAG_LPDDR3_EXPORT_SEQ_AVALON_SLAVE CAL_DEBUG_EXPORT_MODE_DISABLED
set_instance_parameter_value emif_a10_hps_0 DIAG_LPDDR3_EX_DESIGN_ISSP_EN true
set_instance_parameter_value emif_a10_hps_0 DIAG_LPDDR3_EX_DESIGN_NUM_OF_SLAVES 1
set_instance_parameter_value emif_a10_hps_0 DIAG_LPDDR3_EX_DESIGN_SEPARATE_RZQS false
set_instance_parameter_value emif_a10_hps_0 DIAG_LPDDR3_INTERFACE_ID 0
set_instance_parameter_value emif_a10_hps_0 DIAG_LPDDR3_SEPARATE_READ_WRITE_ITFS false
set_instance_parameter_value emif_a10_hps_0 DIAG_LPDDR3_SIM_CAL_MODE_ENUM SIM_CAL_MODE_SKIP
set_instance_parameter_value emif_a10_hps_0 DIAG_LPDDR3_SKIP_CA_DESKEW false
set_instance_parameter_value emif_a10_hps_0 DIAG_LPDDR3_SKIP_CA_LEVEL false
set_instance_parameter_value emif_a10_hps_0 DIAG_LPDDR3_TG_BE_PATTERN_LENGTH 8
set_instance_parameter_value emif_a10_hps_0 DIAG_LPDDR3_TG_DATA_PATTERN_LENGTH 8
set_instance_parameter_value emif_a10_hps_0 DIAG_LPDDR3_USE_TG_AVL_2 false
set_instance_parameter_value emif_a10_hps_0 DIAG_QDR2_ABSTRACT_PHY false
set_instance_parameter_value emif_a10_hps_0 DIAG_QDR2_BYPASS_DEFAULT_PATTERN false
set_instance_parameter_value emif_a10_hps_0 DIAG_QDR2_BYPASS_REPEAT_STAGE true
set_instance_parameter_value emif_a10_hps_0 DIAG_QDR2_BYPASS_STRESS_STAGE true
set_instance_parameter_value emif_a10_hps_0 DIAG_QDR2_BYPASS_USER_STAGE true
set_instance_parameter_value emif_a10_hps_0 DIAG_QDR2_EFFICIENCY_MONITOR EFFMON_MODE_DISABLED
set_instance_parameter_value emif_a10_hps_0 DIAG_QDR2_EXPORT_SEQ_AVALON_MASTER false
set_instance_parameter_value emif_a10_hps_0 DIAG_QDR2_EXPORT_SEQ_AVALON_SLAVE CAL_DEBUG_EXPORT_MODE_DISABLED
set_instance_parameter_value emif_a10_hps_0 DIAG_QDR2_EX_DESIGN_ISSP_EN true
set_instance_parameter_value emif_a10_hps_0 DIAG_QDR2_EX_DESIGN_NUM_OF_SLAVES 1
set_instance_parameter_value emif_a10_hps_0 DIAG_QDR2_EX_DESIGN_SEPARATE_RZQS false
set_instance_parameter_value emif_a10_hps_0 DIAG_QDR2_INTERFACE_ID 0
set_instance_parameter_value emif_a10_hps_0 DIAG_QDR2_SEPARATE_READ_WRITE_ITFS false
set_instance_parameter_value emif_a10_hps_0 DIAG_QDR2_SIM_CAL_MODE_ENUM SIM_CAL_MODE_SKIP
set_instance_parameter_value emif_a10_hps_0 DIAG_QDR2_TG_BE_PATTERN_LENGTH 8
set_instance_parameter_value emif_a10_hps_0 DIAG_QDR2_TG_DATA_PATTERN_LENGTH 8
set_instance_parameter_value emif_a10_hps_0 DIAG_QDR2_USE_TG_AVL_2 false
set_instance_parameter_value emif_a10_hps_0 DIAG_QDR4_ABSTRACT_PHY false
set_instance_parameter_value emif_a10_hps_0 DIAG_QDR4_BYPASS_DEFAULT_PATTERN false
set_instance_parameter_value emif_a10_hps_0 DIAG_QDR4_BYPASS_REPEAT_STAGE true
set_instance_parameter_value emif_a10_hps_0 DIAG_QDR4_BYPASS_STRESS_STAGE true
set_instance_parameter_value emif_a10_hps_0 DIAG_QDR4_BYPASS_USER_STAGE true
set_instance_parameter_value emif_a10_hps_0 DIAG_QDR4_EFFICIENCY_MONITOR EFFMON_MODE_DISABLED
set_instance_parameter_value emif_a10_hps_0 DIAG_QDR4_EXPORT_SEQ_AVALON_MASTER false
set_instance_parameter_value emif_a10_hps_0 DIAG_QDR4_EXPORT_SEQ_AVALON_SLAVE CAL_DEBUG_EXPORT_MODE_DISABLED
set_instance_parameter_value emif_a10_hps_0 DIAG_QDR4_EX_DESIGN_ISSP_EN true
set_instance_parameter_value emif_a10_hps_0 DIAG_QDR4_EX_DESIGN_NUM_OF_SLAVES 1
set_instance_parameter_value emif_a10_hps_0 DIAG_QDR4_EX_DESIGN_SEPARATE_RZQS false
set_instance_parameter_value emif_a10_hps_0 DIAG_QDR4_INTERFACE_ID 0
set_instance_parameter_value emif_a10_hps_0 DIAG_QDR4_SEPARATE_READ_WRITE_ITFS false
set_instance_parameter_value emif_a10_hps_0 DIAG_QDR4_SIM_CAL_MODE_ENUM SIM_CAL_MODE_SKIP
set_instance_parameter_value emif_a10_hps_0 DIAG_QDR4_SKIP_VREF_CAL false
set_instance_parameter_value emif_a10_hps_0 DIAG_QDR4_TG_BE_PATTERN_LENGTH 8
set_instance_parameter_value emif_a10_hps_0 DIAG_QDR4_TG_DATA_PATTERN_LENGTH 8
set_instance_parameter_value emif_a10_hps_0 DIAG_QDR4_USE_TG_AVL_2 false
set_instance_parameter_value emif_a10_hps_0 DIAG_RLD2_ABSTRACT_PHY false
set_instance_parameter_value emif_a10_hps_0 DIAG_RLD2_BYPASS_DEFAULT_PATTERN false
set_instance_parameter_value emif_a10_hps_0 DIAG_RLD2_BYPASS_REPEAT_STAGE true
set_instance_parameter_value emif_a10_hps_0 DIAG_RLD2_BYPASS_STRESS_STAGE true
set_instance_parameter_value emif_a10_hps_0 DIAG_RLD2_BYPASS_USER_STAGE true
set_instance_parameter_value emif_a10_hps_0 DIAG_RLD2_EFFICIENCY_MONITOR EFFMON_MODE_DISABLED
set_instance_parameter_value emif_a10_hps_0 DIAG_RLD2_EXPORT_SEQ_AVALON_MASTER false
set_instance_parameter_value emif_a10_hps_0 DIAG_RLD2_EXPORT_SEQ_AVALON_SLAVE CAL_DEBUG_EXPORT_MODE_DISABLED
set_instance_parameter_value emif_a10_hps_0 DIAG_RLD2_EX_DESIGN_ISSP_EN true
set_instance_parameter_value emif_a10_hps_0 DIAG_RLD2_EX_DESIGN_NUM_OF_SLAVES 1
set_instance_parameter_value emif_a10_hps_0 DIAG_RLD2_EX_DESIGN_SEPARATE_RZQS false
set_instance_parameter_value emif_a10_hps_0 DIAG_RLD2_INTERFACE_ID 0
set_instance_parameter_value emif_a10_hps_0 DIAG_RLD2_SEPARATE_READ_WRITE_ITFS false
set_instance_parameter_value emif_a10_hps_0 DIAG_RLD2_SIM_CAL_MODE_ENUM SIM_CAL_MODE_SKIP
set_instance_parameter_value emif_a10_hps_0 DIAG_RLD2_TG_BE_PATTERN_LENGTH 8
set_instance_parameter_value emif_a10_hps_0 DIAG_RLD2_TG_DATA_PATTERN_LENGTH 8
set_instance_parameter_value emif_a10_hps_0 DIAG_RLD2_USE_TG_AVL_2 false
set_instance_parameter_value emif_a10_hps_0 DIAG_RLD3_ABSTRACT_PHY false
set_instance_parameter_value emif_a10_hps_0 DIAG_RLD3_BYPASS_DEFAULT_PATTERN false
set_instance_parameter_value emif_a10_hps_0 DIAG_RLD3_BYPASS_REPEAT_STAGE true
set_instance_parameter_value emif_a10_hps_0 DIAG_RLD3_BYPASS_STRESS_STAGE true
set_instance_parameter_value emif_a10_hps_0 DIAG_RLD3_BYPASS_USER_STAGE true
set_instance_parameter_value emif_a10_hps_0 DIAG_RLD3_EFFICIENCY_MONITOR EFFMON_MODE_DISABLED
set_instance_parameter_value emif_a10_hps_0 DIAG_RLD3_EXPORT_SEQ_AVALON_MASTER false
set_instance_parameter_value emif_a10_hps_0 DIAG_RLD3_EXPORT_SEQ_AVALON_SLAVE CAL_DEBUG_EXPORT_MODE_DISABLED
set_instance_parameter_value emif_a10_hps_0 DIAG_RLD3_EX_DESIGN_ISSP_EN true
set_instance_parameter_value emif_a10_hps_0 DIAG_RLD3_EX_DESIGN_NUM_OF_SLAVES 1
set_instance_parameter_value emif_a10_hps_0 DIAG_RLD3_EX_DESIGN_SEPARATE_RZQS false
set_instance_parameter_value emif_a10_hps_0 DIAG_RLD3_INTERFACE_ID 0
set_instance_parameter_value emif_a10_hps_0 DIAG_RLD3_SEPARATE_READ_WRITE_ITFS false
set_instance_parameter_value emif_a10_hps_0 DIAG_RLD3_SIM_CAL_MODE_ENUM SIM_CAL_MODE_SKIP
set_instance_parameter_value emif_a10_hps_0 DIAG_RLD3_TG_BE_PATTERN_LENGTH 8
set_instance_parameter_value emif_a10_hps_0 DIAG_RLD3_TG_DATA_PATTERN_LENGTH 8
set_instance_parameter_value emif_a10_hps_0 DIAG_RLD3_USE_TG_AVL_2 false
set_instance_parameter_value emif_a10_hps_0 DIAG_RS232_UART_BAUDRATE 57600
set_instance_parameter_value emif_a10_hps_0 DIAG_SIM_REGTEST_MODE false
set_instance_parameter_value emif_a10_hps_0 DIAG_SOFT_NIOS_CLOCK_FREQUENCY 100
set_instance_parameter_value emif_a10_hps_0 DIAG_SOFT_NIOS_MODE SOFT_NIOS_MODE_DISABLED
set_instance_parameter_value emif_a10_hps_0 DIAG_SYNTH_FOR_SIM false
set_instance_parameter_value emif_a10_hps_0 DIAG_TG_AVL_2_EXPORT_CFG_INTERFACE false
set_instance_parameter_value emif_a10_hps_0 DIAG_TG_AVL_2_NUM_CFG_INTERFACES 0
set_instance_parameter_value emif_a10_hps_0 DIAG_TIMING_REGTEST_MODE false
set_instance_parameter_value emif_a10_hps_0 DIAG_USE_BOARD_DELAY_MODEL false
set_instance_parameter_value emif_a10_hps_0 DIAG_USE_RS232_UART false
set_instance_parameter_value emif_a10_hps_0 DIAG_VERBOSE_IOAUX false
set_instance_parameter_value emif_a10_hps_0 EX_DESIGN_GUI_DDR3_GEN_SIM true
set_instance_parameter_value emif_a10_hps_0 EX_DESIGN_GUI_DDR3_GEN_SYNTH true
set_instance_parameter_value emif_a10_hps_0 EX_DESIGN_GUI_DDR3_HDL_FORMAT HDL_FORMAT_VERILOG
set_instance_parameter_value emif_a10_hps_0 EX_DESIGN_GUI_DDR3_PREV_PRESET TARGET_DEV_KIT_NONE
set_instance_parameter_value emif_a10_hps_0 EX_DESIGN_GUI_DDR3_SEL_DESIGN AVAIL_EX_DESIGNS_GEN_DESIGN
set_instance_parameter_value emif_a10_hps_0 EX_DESIGN_GUI_DDR3_TARGET_DEV_KIT TARGET_DEV_KIT_NONE
set_instance_parameter_value emif_a10_hps_0 EX_DESIGN_GUI_DDR4_GEN_SIM true
set_instance_parameter_value emif_a10_hps_0 EX_DESIGN_GUI_DDR4_GEN_SYNTH true
set_instance_parameter_value emif_a10_hps_0 EX_DESIGN_GUI_DDR4_HDL_FORMAT HDL_FORMAT_VHDL
set_instance_parameter_value emif_a10_hps_0 EX_DESIGN_GUI_DDR4_PREV_PRESET TARGET_DEV_KIT_NONE
set_instance_parameter_value emif_a10_hps_0 EX_DESIGN_GUI_DDR4_SEL_DESIGN AVAIL_EX_DESIGNS_GEN_DESIGN
set_instance_parameter_value emif_a10_hps_0 EX_DESIGN_GUI_DDR4_TARGET_DEV_KIT TARGET_DEV_KIT_NONE
set_instance_parameter_value emif_a10_hps_0 EX_DESIGN_GUI_LPDDR3_GEN_SIM true
set_instance_parameter_value emif_a10_hps_0 EX_DESIGN_GUI_LPDDR3_GEN_SYNTH true
set_instance_parameter_value emif_a10_hps_0 EX_DESIGN_GUI_LPDDR3_HDL_FORMAT HDL_FORMAT_VERILOG
set_instance_parameter_value emif_a10_hps_0 EX_DESIGN_GUI_LPDDR3_PREV_PRESET TARGET_DEV_KIT_NONE
set_instance_parameter_value emif_a10_hps_0 EX_DESIGN_GUI_LPDDR3_SEL_DESIGN AVAIL_EX_DESIGNS_GEN_DESIGN
set_instance_parameter_value emif_a10_hps_0 EX_DESIGN_GUI_LPDDR3_TARGET_DEV_KIT TARGET_DEV_KIT_NONE
set_instance_parameter_value emif_a10_hps_0 EX_DESIGN_GUI_QDR2_GEN_SIM true
set_instance_parameter_value emif_a10_hps_0 EX_DESIGN_GUI_QDR2_GEN_SYNTH true
set_instance_parameter_value emif_a10_hps_0 EX_DESIGN_GUI_QDR2_HDL_FORMAT HDL_FORMAT_VERILOG
set_instance_parameter_value emif_a10_hps_0 EX_DESIGN_GUI_QDR2_PREV_PRESET TARGET_DEV_KIT_NONE
set_instance_parameter_value emif_a10_hps_0 EX_DESIGN_GUI_QDR2_SEL_DESIGN AVAIL_EX_DESIGNS_GEN_DESIGN
set_instance_parameter_value emif_a10_hps_0 EX_DESIGN_GUI_QDR2_TARGET_DEV_KIT TARGET_DEV_KIT_NONE
set_instance_parameter_value emif_a10_hps_0 EX_DESIGN_GUI_QDR4_GEN_SIM true
set_instance_parameter_value emif_a10_hps_0 EX_DESIGN_GUI_QDR4_GEN_SYNTH true
set_instance_parameter_value emif_a10_hps_0 EX_DESIGN_GUI_QDR4_HDL_FORMAT HDL_FORMAT_VERILOG
set_instance_parameter_value emif_a10_hps_0 EX_DESIGN_GUI_QDR4_PREV_PRESET TARGET_DEV_KIT_NONE
set_instance_parameter_value emif_a10_hps_0 EX_DESIGN_GUI_QDR4_SEL_DESIGN AVAIL_EX_DESIGNS_GEN_DESIGN
set_instance_parameter_value emif_a10_hps_0 EX_DESIGN_GUI_QDR4_TARGET_DEV_KIT TARGET_DEV_KIT_NONE
set_instance_parameter_value emif_a10_hps_0 EX_DESIGN_GUI_RLD2_GEN_SIM true
set_instance_parameter_value emif_a10_hps_0 EX_DESIGN_GUI_RLD2_GEN_SYNTH true
set_instance_parameter_value emif_a10_hps_0 EX_DESIGN_GUI_RLD2_HDL_FORMAT HDL_FORMAT_VERILOG
set_instance_parameter_value emif_a10_hps_0 EX_DESIGN_GUI_RLD2_PREV_PRESET TARGET_DEV_KIT_NONE
set_instance_parameter_value emif_a10_hps_0 EX_DESIGN_GUI_RLD2_SEL_DESIGN AVAIL_EX_DESIGNS_GEN_DESIGN
set_instance_parameter_value emif_a10_hps_0 EX_DESIGN_GUI_RLD2_TARGET_DEV_KIT TARGET_DEV_KIT_NONE
set_instance_parameter_value emif_a10_hps_0 EX_DESIGN_GUI_RLD3_GEN_SIM true
set_instance_parameter_value emif_a10_hps_0 EX_DESIGN_GUI_RLD3_GEN_SYNTH true
set_instance_parameter_value emif_a10_hps_0 EX_DESIGN_GUI_RLD3_HDL_FORMAT HDL_FORMAT_VERILOG
